# Altium project DOG.PrjPCB
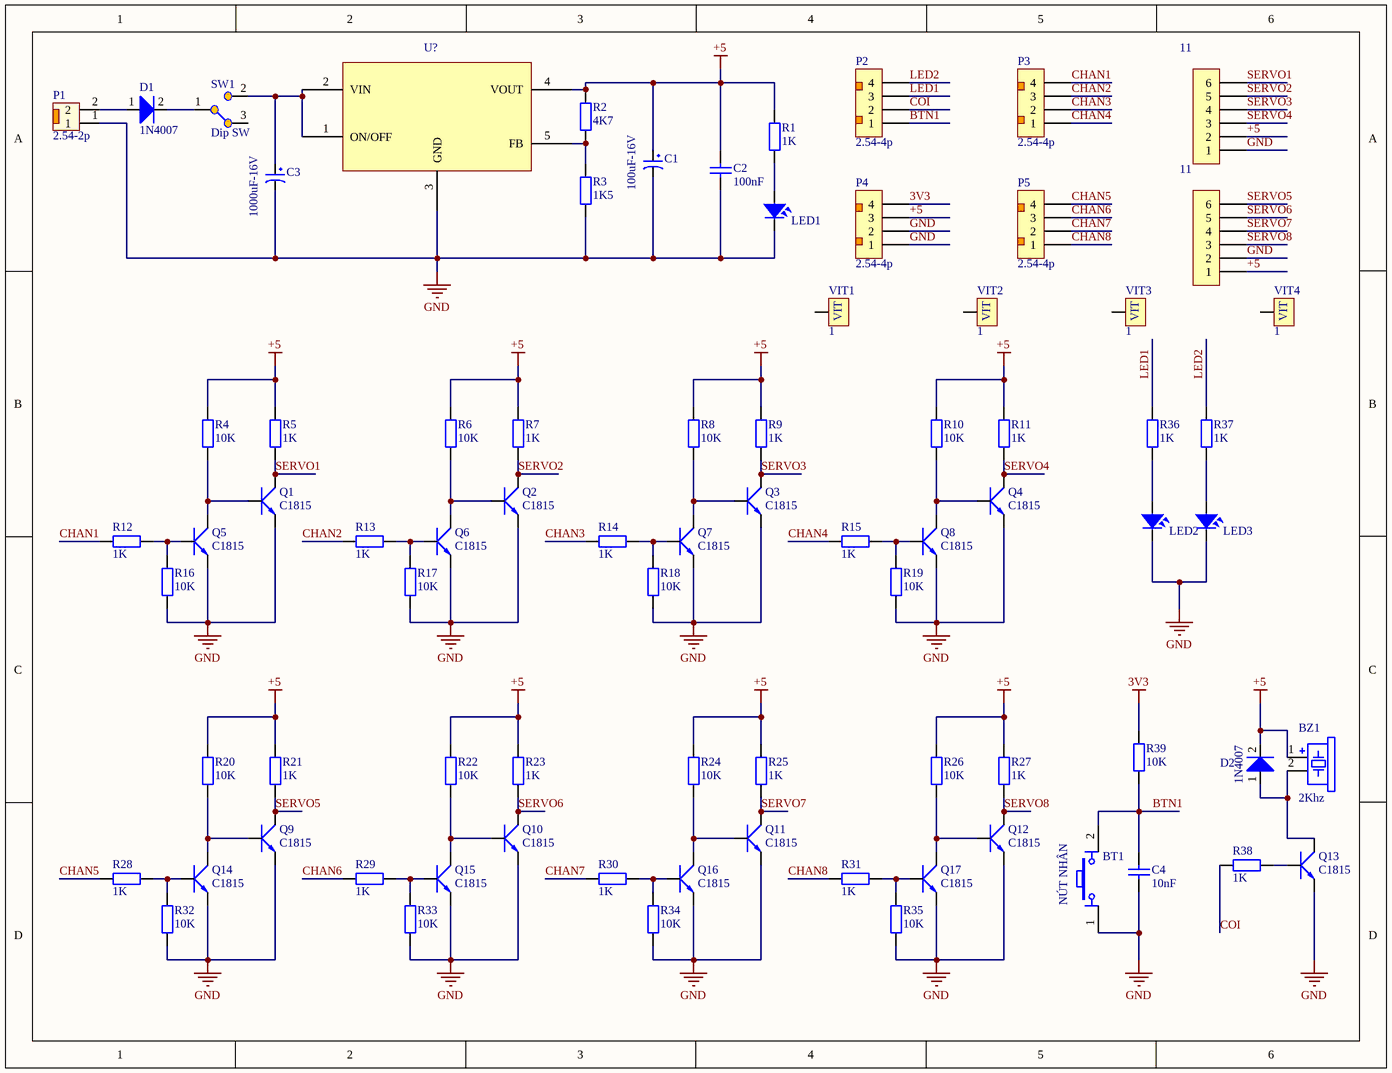
[diagram p0: DOG.SchDoc]
1 sheet, 80 parts. Net scope: global (net labels, ports and power ports of the same name join across sheets).
Board file: DOG.PcbDoc

## Sheet DOG.SchDoc
size 260 x 199 mm

### Parts
BT1  NÚT NHÂN  [Nut Nhan 4 Chan Cam 6x6]
BZ1  2Khz  [coi xung]
C1  100uF-16V  [tu hoa 5mm]
C2  100nF  [tu gom]
C3  1000uF-16V  [tu hoa 8mm]
C4  10nF  [tu gom]
D1  1N4007  [D5A]
D2  1N4007  [1N4007]
H1  11  [XH2.54M-6]
H2  11  [XH2.54M-6]
LED1  LED  [LED-5-RED]  (value not drawn)
LED2  LED  [LED-5-RED]  (value not drawn)
LED3  LED  [LED-5-Green]  (value not drawn)
MIC1  U?  [Mic5V]
P1  2.54-2p  [Header Duc Thang 2P 2.54]
P2  2.54-4p  [Header Duc Thang 4p 2.54]
P3  2.54-4p  [Header Duc Thang 4p 2.54]
P4  2.54-4p  [Header Duc Thang 4p 2.54]
P5  2.54-4p  [Header Duc Thang 4p 2.54]
Q1  C1815  [QTO-92]
Q2  C1815  [QTO-92]
Q3  C1815  [QTO-92]
Q4  C1815  [QTO-92]
Q5  C1815  [QTO-92]
Q6  C1815  [QTO-92]
Q7  C1815  [QTO-92]
Q8  C1815  [QTO-92]
Q9  C1815  [QTO-92]
Q10  C1815  [QTO-92]
Q11  C1815  [QTO-92]
Q12  C1815  [QTO-92]
Q13  C1815  [QTO-92]
Q14  C1815  [QTO-92]
Q15  C1815  [QTO-92]
Q16  C1815  [QTO-92]
Q17  C1815  [QTO-92]
R1  1K  [tro vach 1/4w]
R2  4K7  [tro vach 1/4w]
R3  1K5  [tro vach 1/4w]
R4  10K  [tro vach 1/4w]
R5  1K  [tro vach 1/4w]
R6  10K  [tro vach 1/4w]
R7  1K  [tro vach 1/4w]
R8  10K  [tro vach 1/4w]
R9  1K  [tro vach 1/4w]
R10  10K  [tro vach 1/4w]
R11  1K  [tro vach 1/4w]
R12  1K  [tro vach 1/4w]
R13  1K  [tro vach 1/4w]
R14  1K  [tro vach 1/4w]
R15  1K  [tro vach 1/4w]
R16  10K  [tro vach 1/4w]
R17  10K  [tro vach 1/4w]
R18  10K  [tro vach 1/4w]
R19  10K  [tro vach 1/4w]
R20  10K  [tro vach 1/4w]
R21  1K  [tro vach 1/4w]
R22  10K  [tro vach 1/4w]
R23  1K  [tro vach 1/4w]
R24  10K  [tro vach 1/4w]
R25  1K  [tro vach 1/4w]
R26  10K  [tro vach 1/4w]
R27  1K  [tro vach 1/4w]
R28  1K  [tro vach 1/4w]
R29  1K  [tro vach 1/4w]
R30  1K  [tro vach 1/4w]
R31  1K  [tro vach 1/4w]
R32  10K  [tro vach 1/4w]
R33  10K  [tro vach 1/4w]
R34  10K  [tro vach 1/4w]
R35  10K  [tro vach 1/4w]
R36  1K  [tro vach 1/4w]
R37  1K  [tro vach 1/4w]
R38  1K  [tro vach 1/4w]
R39  10K  [tro vach 1/4w]
SW1  Dip SW  [SW3P]
VIT1  1  [VIT]
VIT2  1  [VIT]
VIT3  1  [VIT]
VIT4  1  [VIT]

### Nets
3V3: P4.4 R39.2
+5: BZ1.1 C1.1 C2.1 D2.2(K) H1.2 H2.1 MIC1.4(VOUT) P4.3 R1.1 R2.2 R4.2 R5.2 R6.2 R7.2 R8.2 R9.2 R10.2 R11.2 R20.2 R21.2 R22.2 R23.2 R24.2 R25.2 R26.2 R27.2
GND: BT1.1 C1.2 C2.2 C3.2 C4.2 H1.1 H2.2 LED1.2 LED2.2 LED3.2 MIC1.3(GND) P1.1 P4.1 P4.2 Q1.1(E) Q2.1(E) Q3.1(E) Q4.1(E) Q5.1(E) Q6.1(E) Q7.1(E) Q8.1(E) Q9.1(E) Q10.1(E) Q11.1(E) Q12.1(E) Q13.1(E) Q14.1(E) Q15.1(E) Q16.1(E) Q17.1(E) R3.1 R16.1 R17.1 R18.1 R19.1 R32.1 R33.1 R34.1 R35.1
BTN1: BT1.2 C4.1 P2.1 R39.1
CHAN1: P3.4 R12.2
CHAN2: P3.3 R13.2
CHAN3: P3.2 R14.2
CHAN4: P3.1 R15.2
CHAN5: P5.4 R28.2
CHAN6: P5.3 R29.2
CHAN7: P5.2 R30.2
CHAN8: P5.1 R31.2
COI: P2.2 R38.2
LED1: P2.3 R36.1
LED2: P2.4 R37.1
SERVO1: H1.6 Q1.2(C) R5.1
SERVO2: H1.5 Q2.2(C) R7.1
SERVO3: H1.4 Q3.2(C) R9.1
SERVO4: H1.3 Q4.2(C) R11.1
SERVO5: H2.6 Q9.2(C) R21.1
SERVO6: H2.5 Q10.2(C) R23.1
SERVO7: H2.4 Q11.2(C) R25.1
SERVO8: H2.3 Q12.2(C) R27.1
NetBZ1_2: BZ1.2 D2.1(A) Q13.2(C)
NetC3_1: C3.1 MIC1.1(ON/OFF) MIC1.2(VIN) SW1.2(NC)
NetD1_1: D1.1(A) P1.2
NetD1_2: D1.2(K) SW1.1(COM)
NetLED1_1: LED1.1 R1.2
NetLED2_1: LED2.1 R36.2
NetLED3_1: LED3.1 R37.2
NetMIC1_5: MIC1.5(FB) R2.1 R3.2
NetQ1_3: Q1.3(B) Q5.2(C) R4.1
NetQ2_3: Q2.3(B) Q6.2(C) R6.1
NetQ3_3: Q3.3(B) Q7.2(C) R8.1
NetQ4_3: Q4.3(B) Q8.2(C) R10.1
NetQ5_3: Q5.3(B) R12.1 R16.2
NetQ6_3: Q6.3(B) R13.1 R17.2
NetQ7_3: Q7.3(B) R14.1 R18.2
NetQ8_3: Q8.3(B) R15.1 R19.2
NetQ9_3: Q9.3(B) Q14.2(C) R20.1
NetQ10_3: Q10.3(B) Q15.2(C) R22.1
NetQ11_3: Q11.3(B) Q16.2(C) R24.1
NetQ12_3: Q12.3(B) Q17.2(C) R26.1
NetQ13_3: Q13.3(B) R38.1
NetQ14_3: Q14.3(B) R28.1 R32.2
NetQ15_3: Q15.3(B) R29.1 R33.2
NetQ16_3: Q16.3(B) R30.1 R34.2
NetQ17_3: Q17.3(B) R31.1 R35.2

Not connected (* = marked no-connect by the designer): SW1 3(NO); VIT1 VIT1(1); VIT2 VIT1(1); VIT3 VIT1(1); VIT4 VIT1(1)

### Library data of the parts
BT1 = Nut Nhan 4 Chan Cam 6x6: Nut Nhan 4 Chan 6x6mm; Ten: Nút Nhấn 4 Chân 6x6x5MM DIP; Ma_Hang: MH004584
BZ1 = Coi xung 2Khz: Cắm; Don_Vi: Con; Ma_Hang: MH007704; Ten_Linh_Kien: Còi Xung 8.5x12MM 16R 2Khz 3-12V; Chung_Loai: Cắm
C1 = Tu Hoa 100uF 16V 5x7: Cắm; Don_Vi: Con; So_Chan: 2; Ten_Linh_Kien: Tụ Hóa 100uF 16V 5x7MM; Ma_Hang: MH001347; Chung_Loai: Cắm; Kieu_Chan: *
C2 C4 = Tu gom 20pF 50V: Căm; Chung_Loai: Cắm; So_Chan: 2; Ten_Linh_Kien: Tụ gốm 20P 50V; Don_Vi: Con; Ma_Hang: MH004768; Kieu_Chan: *
C3 = Tu Hoa 1000uF 16V 8x20: Cắm; Don_Vi: Con; So_Chan: 2; Ten_Linh_Kien: Tụ Hóa 1000uF 16V 8x20MM; Ma_Hang: MH008300; Chung_Loai: Cắm; Kieu_Chan: *
D1 D2 = 1N4007: Diode LS 1A 1000V DO-41; ComponentLink1Description: Datasheet; ComponentLink1URL: D:\Dropbox\Datasheets\Diodes and Rectifiers\Diodes\1N400X.pdf; Unit Price: 0.0072
H1 H2 = Header 6P 2.54 Duc Thang: Cắm; Ten_Linh_Kien: Header 6P XH2.54-6P Đực Thẳng; Don_Vi: Con; Ma_Hang: MH001972; Chung_Loai: Cắm
LED1-LED3 = LED: LED Single colour Green and Red; Value: LED 3 ly Single Colour
MIC1 = Mic5V: 3A
P1 = Header 2.54-2p Duc Thang: Cắm; So_Chan: 2; Don_Vi: Con; Ten_Linh_Kien: Header 2P XH2.54-2P Đực Thẳng; Ma_Hang: MH001283; Chung_Loai: Cắm; Kieu_Chan: *
P2-P5 = Header 2.54_4p Duc Thang: Cắm; Don_Vi: Con; So_Chan: 4; Ten_Linh_Kien: Header 4P XH2.54-4P Đực Thẳng; Ma_Hang: MH001285; Chung_Loai: Cắm; Kieu_Chan: *
Q1-Q17 = C1815: NPN 600mW, ECB; Value: C1815
R1-R39 = Tro Vach 1/4W 5% 1k: Cắm; Don_Vi: Con; So_Chan: 2; Ten_Linh_Kien: Trở Vạch 1/4w 5% 1k; Ma_Hang: MH007390; Chung_Loai: Cắm; Kieu_Chan: *
SW1 = Switch3P: Dip Switch 3 pin
VIT1-VIT4 = VIT: Oc Vit